# EAGLE design PCB-TLY-BRD1 (EAGLE 7.1.0)
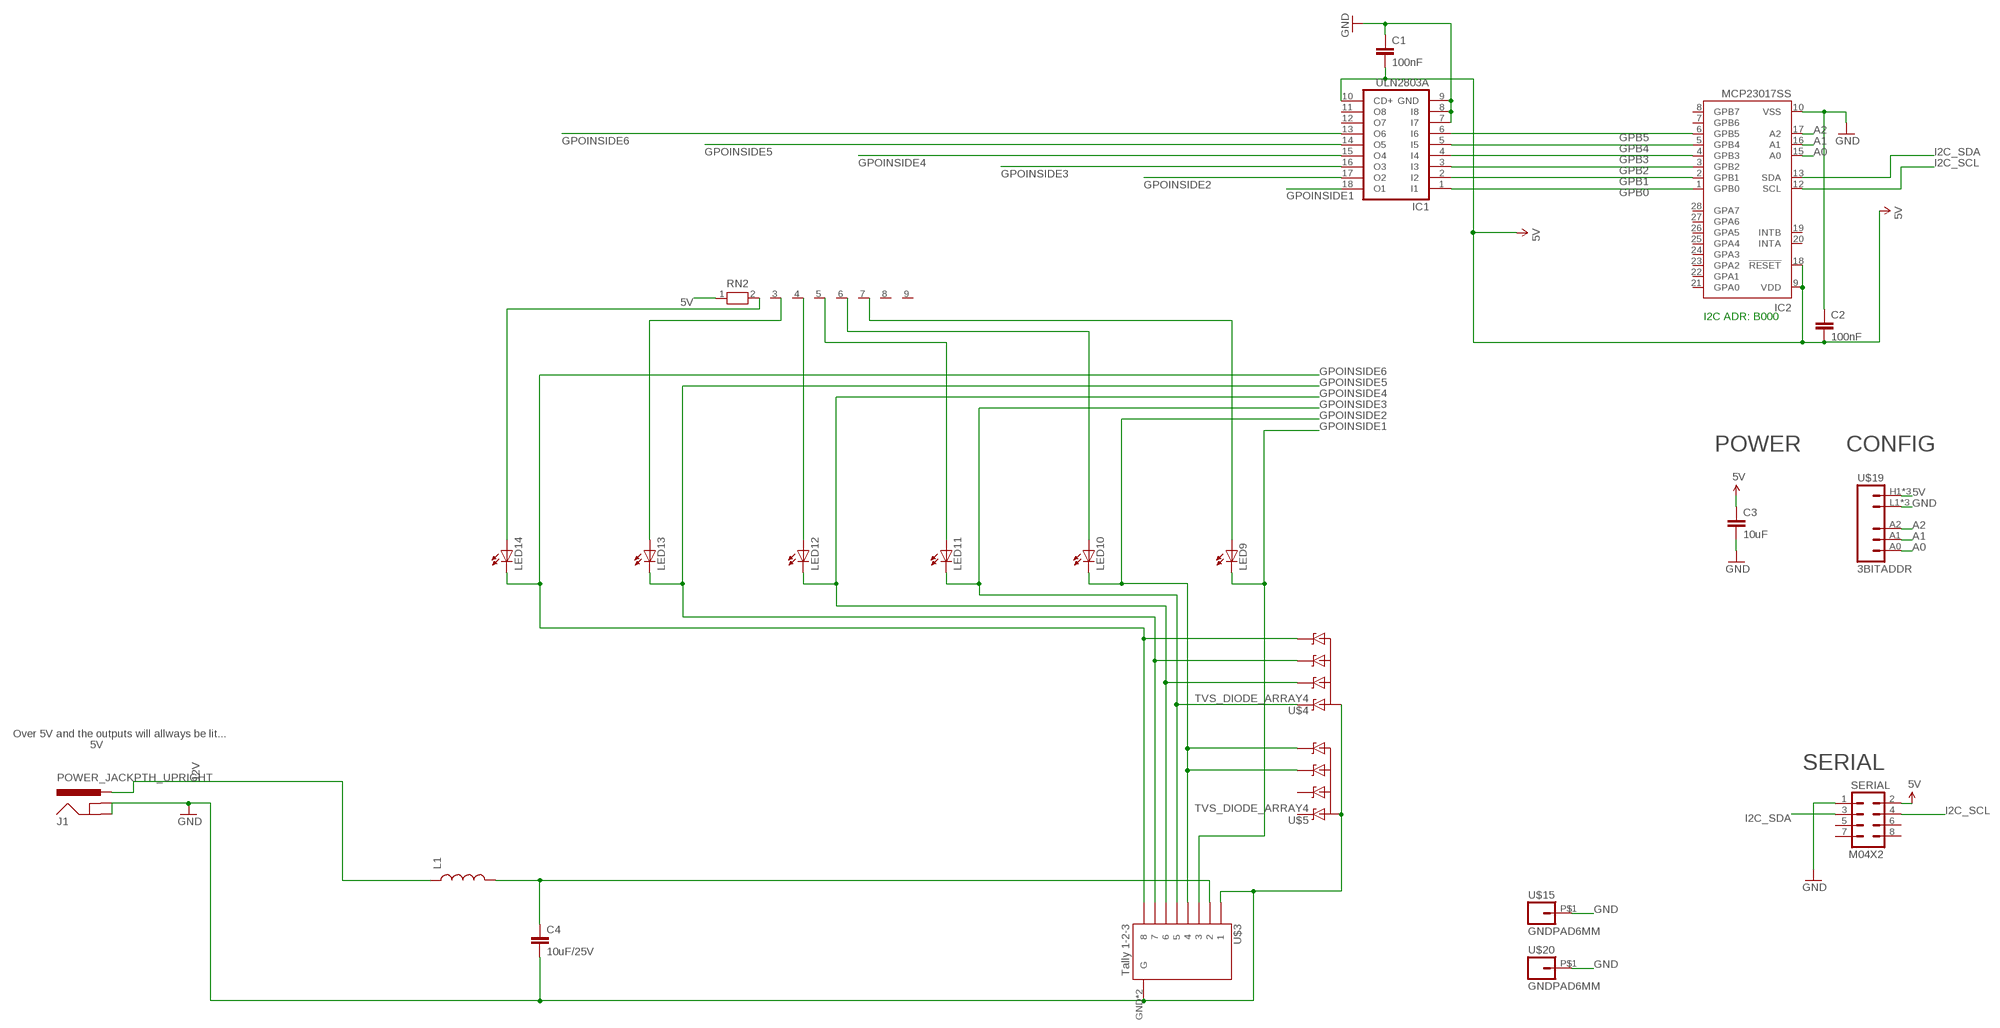
[diagram p0: schematic, sheet 1]

## Parts
C1  100nF  CAP0805  [0805]
C2  100nF  CAP0603-CAP  [0603-CAP]
C3  10uF  CAP0805  [0805]
C4  10uF/25V  CAP0805  [0805]
IC1  ULN2803A  ULN2803ASO18W  [SO18W]
IC2  MCP23017SS  [SSOP28]
J1  POWER_JACKPTH_UPRIGHT  [POWER_JACK_PTH_UPRIGHT]
L1  INDUCTOR0805  [0805]
LED9  LED3MM  [LED3MM]
LED10  LED3MM  [LED3MM]
LED11  LED3MM  [LED3MM]
LED12  LED3MM  [LED3MM]
LED13  LED3MM  [LED3MM]
LED14  LED3MM  [LED3MM]
RN2  RN08  [RN-9]
SERIAL  M04X2  [2X4]
U$3  Tally 1-2-3  RJ45-8_GNDUPRIGHT  [RJ45-8_GND_UPRIGHT]
U$4  TVS_DIODE_ARRAY4  [SOT23-6L]
U$5  TVS_DIODE_ARRAY4  [SOT23-6L]
U$15  GNDPAD6MM  [3.2MMPAD6MM]
U$19  3BITADDR  [3BITADDR]
U$20  GNDPAD6MM  [3.2MMPAD6MM]

## Nets
5V [Power]: C1.2 C2.2 C3.1 IC1.10(CD+) IC2.9(VDD) IC2.18(!RESET) RN2.1 SERIAL.2 U$19.H1(VCC) U$19.H2(VCC) U$19.H3(VCC)
12V [Power]: J1.PWR L1.1
A0: IC2.15(A0) U$19.A0
A1: IC2.16(A1) U$19.A1
A2: IC2.17(A2) U$19.A2
GND [Power]: C1.1 C2.1 C3.2 C4.2 IC1.7(I7) IC1.8(I8) IC1.9(GND) IC2.10(VSS) J1.GND SERIAL.1 U$3.1 U$3.GND1(G) U$3.GND(G) U$4.2(GND) U$4.5(GND) U$5.2(GND) U$5.5(GND) U$15.P$1 U$19.L1(GND) U$19.L2(GND) U$19.L3(GND) U$20.P$1
GPB0: IC1.1(I1) IC2.1(GPB0)
GPB1: IC1.2(I2) IC2.2(GPB1)
GPB2: IC1.3(I3) IC2.3(GPB2)
GPB3: IC1.4(I4) IC2.4(GPB3)
GPB4: IC1.5(I5) IC2.5(GPB4)
GPB5: IC1.6(I6) IC2.6(GPB5)
GPOINSIDE1: IC1.18(O1) LED9.K(C) U$3.3
GPOINSIDE2: IC1.17(O2) LED10.K(C) U$3.4 U$5.4(C) U$5.6(D)
GPOINSIDE3: IC1.16(O3) LED11.K(C) U$3.5 U$4.1(A)
GPOINSIDE4: IC1.15(O4) LED12.K(C) U$3.6 U$4.3(B)
GPOINSIDE5: IC1.14(O5) LED13.K(C) U$3.7 U$4.4(C)
GPOINSIDE6: IC1.13(O6) LED14.K(C) U$3.8 U$4.6(D)
I2C_SCL: IC2.12(SCL) SERIAL.4
I2C_SDA: IC2.13(SDA) SERIAL.3
N$2 [Power]: C4.1 L1.2 U$3.2
N$19: LED14.A RN2.2
N$20: LED13.A RN2.3
N$22: LED12.A RN2.4
N$23: LED11.A RN2.5
N$24: LED10.A RN2.6
N$26: LED9.A RN2.7
Unconnected: IC1.11(O8) IC1.12(O7) IC2.7(GPB6) IC2.8(GPB7) IC2.19(INTB) IC2.20(INTA) IC2.21(GPA0) IC2.22(GPA1) IC2.23(GPA2) IC2.24(GPA3) IC2.25(GPA4) IC2.26(GPA5) IC2.27(GPA6) IC2.28(GPA7) J1.SHUNT(GNDBREAK) RN2.8 RN2.9 SERIAL.5 SERIAL.6 SERIAL.7 SERIAL.8 U$5.1(A) U$5.3(B)

## Notes on the sheet
- I2C ADR: B000
- POWER | CONFIG
- Over 5V and the outputs will allways be lit...
- 5V
- SERIAL

## Library data of the parts
C1-C4 = SparkFun:CAP: Capacitor Standard 0603 ceramic capacitor, and 0.1" leaded capacitor.
IC1 = uln-udn:ULN2803A: DRIVER ARRAY
IC2 = microchip:MCP23017: http://ww1.microchip.com/downloads/en/DeviceDoc/21952a.pdf Source: http://ww1.microchip.com/downloads/en/DeviceDoc/21952a.pdf; MF: MICROCHIP; MPN: MCP23017-E/SS; OC_FARNELL: 1467674; OC_NEWARK: 31K2960
J1 = SKAARHOJ:POWER_JACK: RASM712PX Right Angle SMT Mount DC Power Jack, pin size 0.100"(2.5mm), with locating post Switchcraft.com
L1 = SparkFun:INDUCTOR: Inductors Basic Inductor/Choke - 0603 and 1206. Footprints are not proven and vary greatly between part numbers.
LED9-LED14 = led:LED: LED OSRAM: - CHIPLED LG R971, LG N971, LY N971, LG Q971, LY Q971, LO R971, LY R971 LH N974, LH R974 LS Q976, LO Q976, LY Q976 LO Q996 - Hyper CHIPLED LW Q18S LB Q993, LB Q99A, LB R99A - SideLED LS A670, LO A670, LY A670, LG A670, LP A670 LB A673, LV A673, LT A673, LW A673 LH A674 LY A675 LS A676, LA A676, LO A676, LY A676, LW A676 LS A679, LY A679, LG A679 - Hyper Micro SIDELED® LS Y876, LA Y876, LO Y876, LY Y876 LT Y87S - SmartLED LW L88C, LW L88S LB L89C, LB L89S, LG L890 LS L89K, LO L89K, LY L89K LS L896, LA L896, LO L896, LY L896 - TOPLED LS T670, LO T670, LY T670, LG T670, LP T670 LSG T670, LSP T670, LSY T670, LOP T670, LYG T670 LG T671, LOG T671, LSG T671 LB T673, LV T673, LT T673, LW T673 LH T674 LS T676, LA T676, LO T676, LY T676, LB T676, LH T676, LSB T676, LW T676 LB T67C, LV T67C, LT T67C, LS T67K, LO T67K, LY T67K, LW E67C LS E67B, LA E67B, LO E67B, LY E67B, LB E67C, LV E67C, LT E67C LW T67C LS T679, LY T679, LG T679 LS T770, LO T770, LY T770, LG T770, LP T770 LB T773, LV T773, LT T773, LW T773 LH T774 LS E675, LA E675, LY E675, LS T675 LS T776, LA T776, LO T776, LY T776, LB T776 LHGB T686 LT T68C, LB T68C - Hyper Mini TOPLED® LB M676 - Mini TOPLED Santana® LG M470 LS M47K, LO M47K, LY M47K Source: http://www.osram.convergy.de LUXEON: - LUMILED® LXK2-PW12-R00, LXK2-PW12-S00, LXK2-PW14-U00, LXK2-PW14-V00 LXK2-PM12-R00, LXK2-PM12-S00, LXK2-PM14-U00 LXK2-PE12-Q00, LXK2-PE12-R00, LXK2-PE12-S00, LXK2-PE14-T00, LXK2-PE14-U00 LXK2-PB12-K00, LXK2-PB12-L00, LXK2-PB12-M00, LXK2-PB14-N00, LXK2-PB14-P00, LXK2-PB14-Q00 LXK2-PR12-L00, LXK2-PR12-M00, LXK2-PR14-Q00, LXK2-PR14-R00 LXK2-PD12-Q00, LXK2-PD12-R00, LXK2-PD12-S00 LXK2-PH12-R00, LXK2-PH12-S00 LXK2-PL12-P00, LXK2-PL12-Q00, LXK2-PL12-R00 Source: www.luxeon.com KINGBRIGHT: KA-3528ASYC Source: www.kingbright.com
RN2 = SKAARHOJ:RN08: RESISTOR NETWORK; OC_FARNELL: unknown; OC_NEWARK: unknown
SERIAL = SparkFun:M04X2
U$3 = SKAARHOJ:RJ45-8_GND
U$4 U$5 = SKAARHOJ:TVS_DIODE_ARRAY4
U$15 U$20 = SKAARHOJ:GNDPAD
U$19 = SKAARHOJ:3BITADDR

## Net classes
0 default: width 0.203 mm, drill 0.406 mm, clearance 0.203 mm
1 Power: width 0.406 mm, drill 0.61 mm, clearance 0.203 mm
2 RELAY LINES: width 0.305 mm, clearance 0.254 mm
3 INput lines: clearance 0.203 mm

## Board
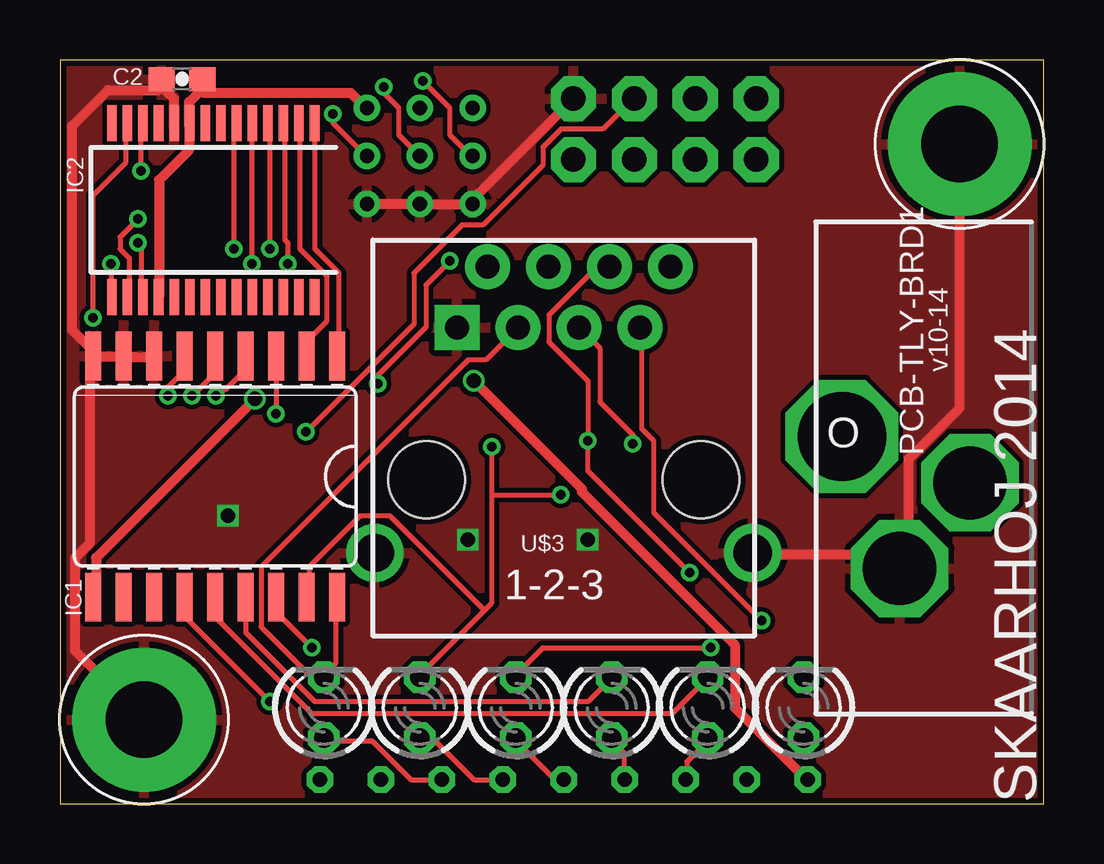
[diagram p1: board, top side]
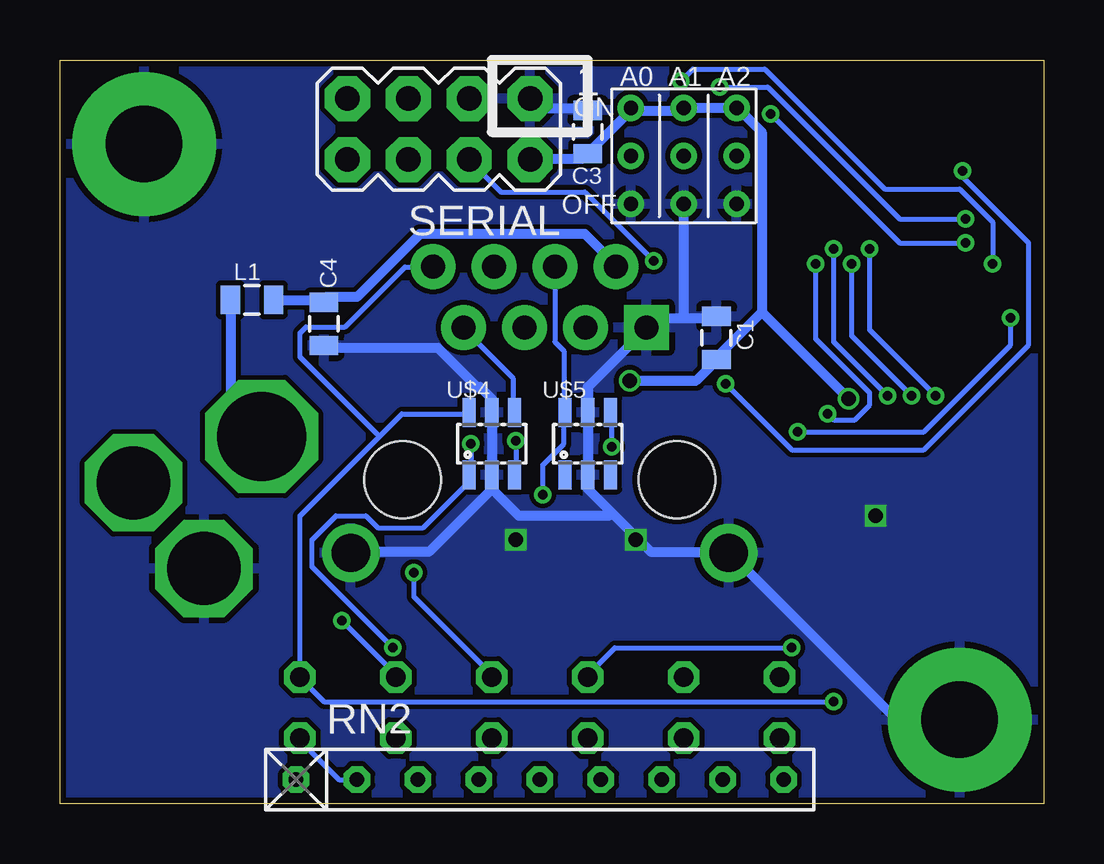
[diagram p2: board, bottom side, seen from below]

Size 41 x 31 mm. Coordinates in mm from the lower left corner, seen from the top.
Outline: 41,0 41,31 0,31 0,0 41,0
Copper layers (1*16): Top 0.035mm / dielectric 1.5mm / Bottom 0.035mm
Design rules "Fusion_eagle_rule_v1.1": minimum track width 6mil, minimum drill 12mil, track to track 6mil, track to pad 6mil, pad to pad 6mil, via to via 6mil, smd to smd 0mil, copper to edge 10mil, drill to drill 10mil, minimum pad ring 10mil, minimum via ring 6mil, stop-mask expansion 2mil, vias tented up to drill 100mil, thermal gap 10mil
bKeepout: area 0,0 to 10,10; area 140,0 to 150,10

### Footprints (pad centres in the part's own frame; a part is rotated, then mirrored left to right if it is on the bottom)
0805 = smd 0.8 x 1.2: 1 -0.9,0; 2 0.9,0
0603-CAP = smd 1.1 x 1: 1 -0.85,0; 2 0.85,0
SO18W = smd 0.66 x 2.032: 1 -5.08,-5.029; 2 -3.81,-5.029; 3 -2.54,-5.029; 4 -1.27,-5.029; 5 0,-5.029; 6 1.27,-5.029; 7 2.54,-5.029; 8 3.81,-5.029; 9 5.08,-5.029; 10 5.08,5.029; 11 3.81,5.029; 12 2.54,5.029; 13 1.27,5.029; 14 0,5.029; 15 -1.27,5.029; 16 -2.54,5.029; 17 -3.81,5.029; 18 -5.08,5.029
SSOP28 = smd 0.4 x 1.5: 1 -4.225,-3.625; 2 -3.575,-3.625; 3 -2.925,-3.625; 4 -2.275,-3.625; 5 -1.625,-3.625; 6 -0.975,-3.625; 7 -0.325,-3.625; 8 0.325,-3.625; 9 0.975,-3.625; 10 1.625,-3.625; 11 2.275,-3.625; 12 2.925,-3.625; 13 3.575,-3.625; 14 4.225,-3.625; 15 4.225,3.625; 16 3.575,3.625; 17 2.925,3.625; 18 2.275,3.625; 19 1.625,3.625; 20 0.975,3.625; 21 0.325,3.625; 22 -0.325,3.625; 23 -0.975,3.625; 24 -1.625,3.625; 25 -2.275,3.625; 26 -2.925,3.625; 27 -3.575,3.625; 28 -4.225,3.625
POWER_JACK_PTH_UPRIGHT = drill 3.048 octagon: GND -1,-4.2; SHUNT 1.935,-0.63 | drill 3.7 octagon: PWR -3.4,1.3
LED3MM = drill 0.813 octagon: A -1.27,0; K 1.27,0
RN-9 = drill 0.6 octagon: 1 -10.16,0; 2 -7.62,0; 3 -5.08,0; 4 -2.54,0; 5 0,0; 6 2.54,0; 7 5.08,0; 8 7.62,0; 9 10.16,0
2X4 = drill 1.016 pad 1.88 octagon: 1 -3.81,-1.27; 2 -3.81,1.27; 3 -1.27,-1.27; 4 -1.27,1.27; 5 1.27,-1.27; 6 1.27,1.27; 7 3.81,-1.27; 8 3.81,1.27
RJ45-8_GND_UPRIGHT = drill 1 pad 1.88 square: 1 -4.445,6.35 | drill 1 pad 1.88: 2 -3.175,8.89; 3 -1.905,6.35; 4 -0.635,8.89; 5 0.635,6.35; 6 1.905,8.89; 7 3.175,6.35; 8 4.445,8.89 | drill 1.6: GND -7.88,-3.05; GND1 7.88,-3.05 | hole 3.2: -5.715,0; 5.715,0
SOT23-6L = smd 0.55 x 1.2: 1 -0.95,-1.3; 2 0,-1.3; 3 0.95,-1.3; 4 0.95,1.3; 5 0,1.3; 6 -0.95,1.3
3.2MMPAD6MM = drill 3.2 pad 6: P$1 0,0
3BITADDR = drill 0.6: A0 -2.2,0; A1 0,0; A2 2.2,0; H1 -2.2,2; H2 0,2; H3 2.2,2; L1 -2.2,-2; L2 0,-2; L3 2.2,-2

### Placement (x,y rotation side)
C1  13.63,19.41 270 bottom
C2  5.09,30.2 0 top
C3  19,28 90 bottom
C4  30,20 270 bottom
IC1  6.47,13.63 180 top
IC2  6.39,24.75 180 top
J1  36,14 0 top
L1  33,21 0 bottom
LED9  11,4 90 top
LED10  15,4 90 top
LED11  19,4 90 top
LED12  23,4 90 top
LED13  27,4 90 top
LED14  31,4 90 top
RN2  21,1 0 bottom
SERIAL  25.21,28.12 180 bottom
U$3  21,13.5 0 top
U$4  23,15 0 bottom
U$5  19,15 0 bottom
U$15  3.5,3.5 0 top
U$19  15,27 0 bottom
U$20  37.5,27.5 0 top

### Tracks (layer width: path | path; a pad name or v marks a point on that pad's centre or on a via)
5V  (via drill 0.61)
  Top 0.406: 5.88,29.75 5.88,30.12 C2.2 | 5.88,29.75 5.38,29.25 5.38,28.38 IC2.9 5.38,28.25 5.38,27.25 4.12,26 IC2.18 | v8.12,16.88 1.5,10.25 1.5,8.62 IC1.10 | v17.25,17.62 21.75,13.12 21.75,13 28.12,6.62 28.12,4 31.12,1 RN2.1 | 5.88,29.75 6,29.62 12.12,29.62 12.75,29 U$19.H3
  Bottom 0.406: 11.75,20.5 13.62,18.62 C1.2 13.75,18.38 14.5,17.62 v17.25,17.62 | 11.75,20.5 11.75,28 12.75,29 U$19.H3 U$19.H2 15.12,28.88 17,28.88 U$19.H1 17.12,29 19,27.12 C3.1 19.12,27 19.25,26.88 21.38,26.88 SERIAL.2 | 11.75,20.5 v8.12,16.88
12V
  Bottom 0.406: L1.1 33.88,21 33.88,16.62 32.62,15.38 J1.PWR
A0  (via drill 0.41)
  Top 0.203: v2.12,22.5 2.12,21.12 IC2.15 | v15.12,30.12 16.25,29 16.25,27.88 17.12,27 U$19.A0
  Bottom 0.203: v2.12,22.5 2.12,24.25 3.5,25.62 6.62,25.62 11.62,30.62 14.62,30.62 v15.12,30.12
A1  (via drill 0.41)
  Top 0.203: v3.25,24.38 2.5,23.62 2.5,23.12 2.88,22.75 2.88,21.12 IC2.16 | v13.5,29.88 13.5,29.62 14.12,29 14.12,27.88 U$19.A1
  Bottom 0.203: v3.25,24.38 6,24.38 11.5,29.88 v13.5,29.88
A2  (via drill 0.41)
  Top 0.203: v3.25,23.38 3.38,23.25 3.38,21.12 IC2.17 | v11.38,28.75 11.38,28.38 12.75,27 U$19.A2
  Bottom 0.203: v3.25,23.38 6,23.38 v11.38,28.75
GND  (via drill 0.6)
  Top 0.406: IC2.10 4.75,29.38 4.25,29.88 4.25,30.12 C2.1 4.12,29.75 2,29.75 0.5,28.25 0.5,19.75 1.38,18.88 IC1.9 | IC1.9 1.5,18.62 2.62,18.62 IC1.8 2.75,18.62 3.88,18.62 IC1.7 | U$15.P$1 0.62,6.38 0.62,10.25 1.25,10.88 1.25,18.5 IC1.9 | U$3.GND1 29,10.38 34.5,10.38 35,9.88 J1.GND 34.62,10.5 35.38,11.25 35.38,14.38 37.5,16.5 U$20.P$1 | U$19.L3 U$19.L2 U$19.L1 17.12,25.12 21.38,29.38 SERIAL.1
  Bottom 0.406: C4.2 30,19 25.25,19 23.62,17.38 23.5,17.38 23,16.88 U$4.5 U$4.2 23,13.12 | C3.2 19,29 21,29 21.38,29.38 SERIAL.1 | 15,20.25 16.12,20.25 16.5,19.88 U$3.1 16.62,19.75 19,17.38 U$5.5 U$5.2 19,13.12 18,12.12 | 15,20.25 13.75,20.25 C1.1 | 15,20.25 U$19.L2 | 18,12.12 16.38,10.5 13.12,10.5 U$3.GND 13,10.38 6.12,3.5 U$15.P$1 | 23,13.12 21.88,12 18.12,12 18,12.12 | 23,13.12 25.62,10.5 28.88,10.5 U$3.GND1
  other vias: 7,12 17,11 22,11
  pour Top: 0,0 41,0 41,31 0,31
  pour Bottom: 0,0 41,0 41,31 0,31
GPB0
  Top 0.203: IC2.1 10.62,28.38 10.62,23.12 11.62,22.12 11.62,18.75 IC1.1
GPB1
  Top 0.203: IC2.2 10,28.38 10,23.12 11.12,22 11.12,20.12 10.38,19.38 10.38,18.75 IC1.2
GPB2  (via drill 0.41)
  Top 0.203: v9.5,22.5 9.5,23.38 9.38,23.5 9.38,28.38 IC2.3 | v9,16.25 9,18.62 IC1.3
  Bottom 0.203: v9.5,22.5 9.5,19.38 7.25,17.12 7.25,16.62 7.88,16 8.75,16 v9,16.25
GPB3  (via drill 0.41)
  Top 0.203: v8.75,23.12 8.75,28.38 IC2.4 | v6.5,17 6.75,17.25 6.88,17.25 7.62,18 7.62,18.62 IC1.4
  Bottom 0.203: v8.75,23.12 8.75,19.25 v6.5,17
GPB4  (via drill 0.41)
  Top 0.203: v8,22.5 8,28.38 IC2.5 | v5.5,17 6.38,17.88 6.38,18.62 IC1.5
  Bottom 0.203: v8,22.5 8,19.5 v5.5,17
GPB5  (via drill 0.41)
  Top 0.203: v7.25,23.12 7.25,28.38 IC2.6 | v4.5,17 4.5,17.38 5.12,18 5.12,18.62 IC1.6
  Bottom 0.203: v7.25,23.12 7.25,19.75 v4.5,17
GPOINSIDE1
  Top 0.203: IC1.18 11.5,8.5 11.5,5.88 11,5.38 LED9.K 11,5.5 10.25,5.5 8.38,7.38 8.38,9.88 17,18.5 17.75,18.5 19,19.75 U$3.3
GPOINSIDE2  (via drill 0.41)
  Top 0.203: 18,12.88 18,8.38 17.69,8.06 | 18,12.88 v18,14.88 | 17.69,8.06 15,5.38 LED10.K | 17.69,8.06 13.75,12 12.5,12 10.38,9.88 10.38,8.62 IC1.17 | 18,12.88 v20.88,12.88
  Bottom 0.203: U$3.4 20.38,22.38 20.38,19.25 20,18.88 20,16.38 U$5.6 20,16.25 20,15 20.88,14.12 v20.88,12.88 | v18,14.88 18,16.25 U$5.4
GPOINSIDE3  (via drill 0.41)
  Top 0.203: v23.88,15 23.88,15.38 22.5,16.75 22.5,19 21.75,19.75 U$3.5 | v10.5,6.5 9.12,7.88 9.12,8.5 IC1.16 | v27.12,6.5 20.12,6.5 19,5.38 LED11.K
  Bottom 0.203: v23.88,15 23.88,13.75 U$4.1 24,13.62 24,13.38 25.88,11.5 27.75,11.5 28.25,12 29.5,12 30.5,11 30.5,9.88 v27.12,6.5 | v10.5,6.5 17.88,6.5 19,5.38 LED11.K
GPOINSIDE4  (via drill 0.41)
  Top 0.203: U$3.6 22.88,22.38 22.38,22.38 20.38,20.38 20.38,19.25 22,17.62 v22,15.12 22,13.88 v26.25,9.62 | IC1.15 7.75,8.5 7.75,7.12 10.62,4.25 22,4.25 23,5.25 LED12.K
  Bottom 0.203: v22,15.12 22,13.75 U$4.3 | v26.25,9.62 26.25,8.62 23,5.38 LED12.K
GPOINSIDE5  (via drill 0.41)
  Top 0.203: IC1.14 6.5,8.5 6.5,7.75 10.5,3.75 25.5,3.75 27,5.25 LED13.K | v29.25,7.62 24.75,12.12 24.75,15.12 24.25,15.62 24.25,19.75 U$3.7
  Bottom 0.203: U$4.4 22.12,16.38 22.12,17.75 24.12,19.75 U$3.7 | v29.25,7.62 27,5.38 LED13.K
GPOINSIDE6  (via drill 0.41)
  Top 0.203: v8.75,4.25 5.25,7.75 5.25,8.5 IC1.13
  Bottom 0.203: 27.69,15.31 31,12 LED14.K 31,5.25 30,4.25 v8.75,4.25 | 27.69,15.31 26.75,16.25 24,16.25 U$4.6 | 27.69,15.31 31,18.62 31,19.62 30.75,19.88 29.12,19.88 26.62,22.38 25.5,22.38 U$3.8
I2C_SCL  (via drill 0.41)
  Top 0.203: v3.38,26.38 3.38,28.38 IC2.12 | v13.25,17.5 13.25,17.88 15.25,19.88 15.25,21.62 v16.25,22.62
  Bottom 0.203: v3.38,26.38 3.38,26.12 0.62,23.38 0.62,19.12 5,14.75 10.5,14.75 v13.25,17.5 | v16.25,22.62 19.12,25.5 22.62,25.5 23.88,26.75 SERIAL.4
I2C_SDA  (via drill 0.41)
  Top 0.203: v1.38,20.25 1.38,25.38 2.75,26.75 2.75,28.38 IC2.13 | v10.25,15.5 14.75,20 14.75,22.12 16.75,24.12 17.62,24.12 20.12,26.62 20.12,27.38 20.88,28.12 22.62,28.12 23.88,29.38 SERIAL.3
  Bottom 0.203: v1.38,20.25 1.38,19.12 5,15.5 v10.25,15.5
N$2
  Bottom 0.406: L1.2 30,21 C4.1 29.88,21.12 28.62,21.12 26,23.75 19.12,23.75 17.88,22.5 U$3.2
N$19
  Bottom 0.203: RN2.2 29.38,1 31,2.62 LED14.A
N$20
  Top 0.203: RN2.3 26.12,1 26.12,1.75 27,2.62 LED13.A
N$22
  Top 0.203: RN2.4 23.5,1 23.5,2.12 23,2.62 LED12.A
N$23
  Top 0.203: RN2.5 20.62,1 19,2.62 LED11.A
N$24
  Top 0.203: RN2.6 17.25,1 15.62,2.62 15,2.62 LED10.A
N$26
  Top 0.203: RN2.7 14.62,1 13,2.62 11,2.62 LED9.A

### Text on the board
_tsilk: v10-14 | O | PCB-TLY-BRD1 | 1-2-3 | SKAARHOJ 2014
_bsilk: 1